# Altium schematic sheet RGB_sensor_.SchDoc
size Letter; SheetNumber: 1; SheetTotal: 1
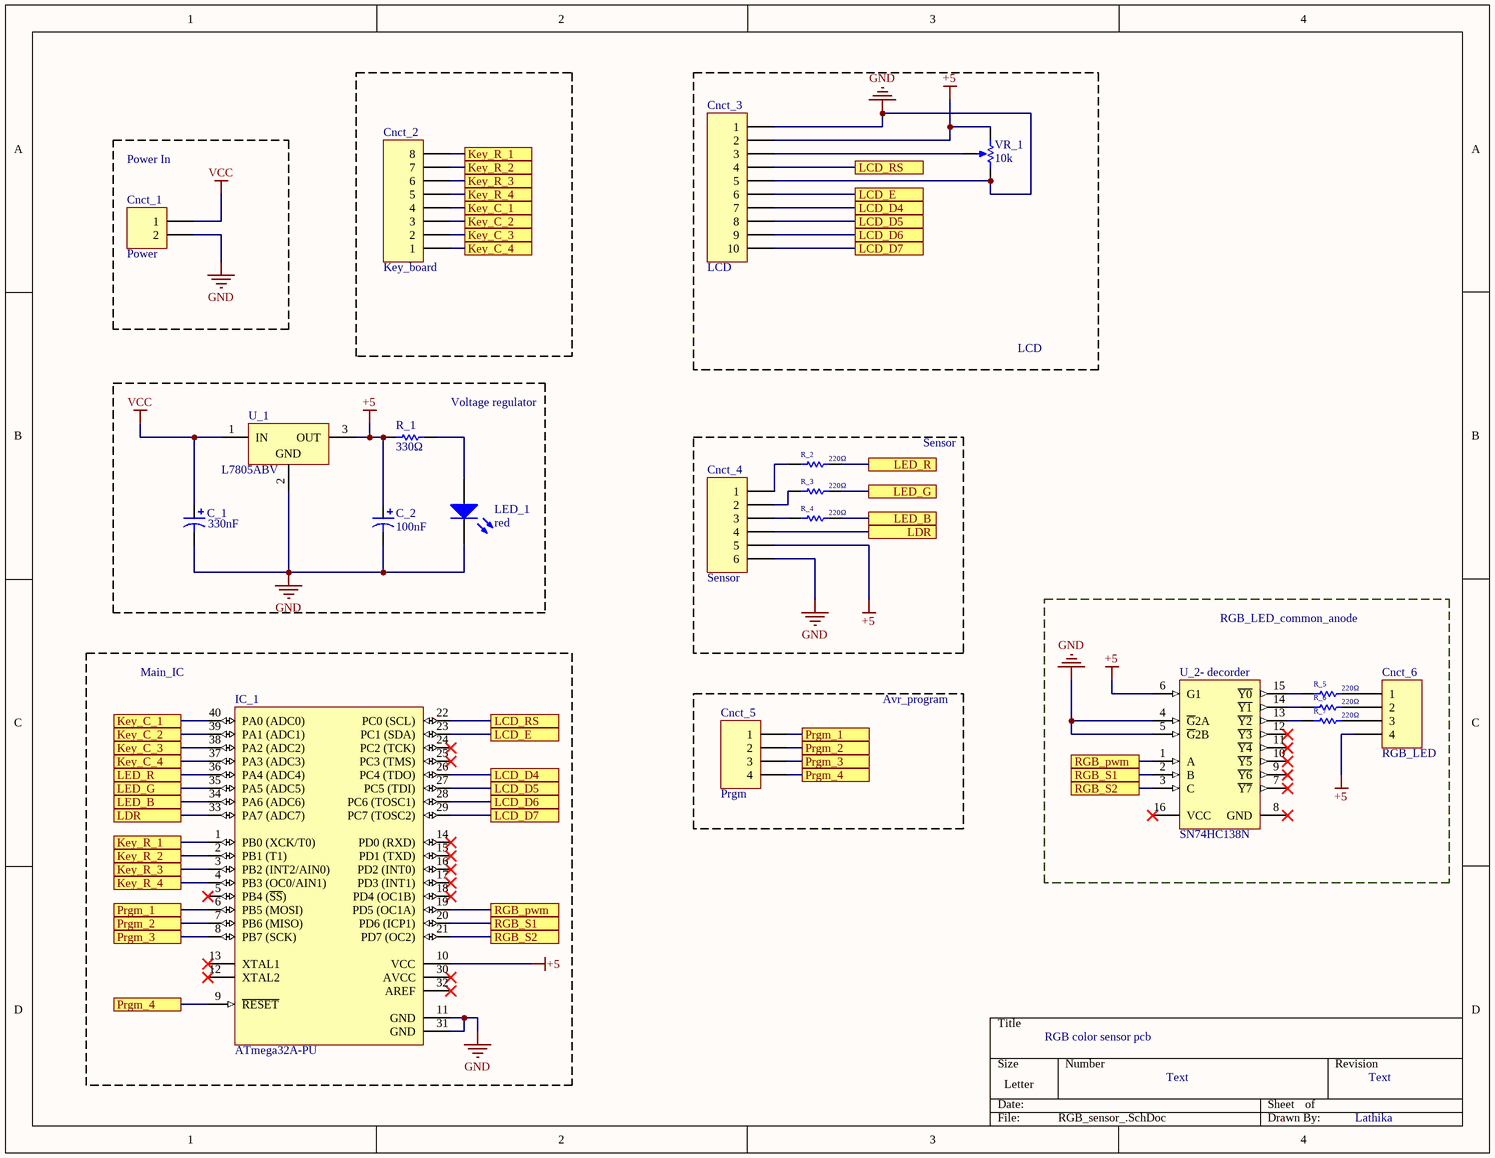
[diagram p0: RGB_sensor_.SchDoc]

## Parts
C_1  330nF  [RB7.6-15]
C_2  100nF  [RB7.6-15]
Cnct_1  Power  [HDR1X2]
Cnct_2  Key_board  [HDR1X8]
Cnct_3  LCD  [HDR1X10]
Cnct_4  Sensor  [HDR1X6]
Cnct_5  Prgm  [HDR1X4]
Cnct_6  RGB_LED  [HDR1X4]
IC_1  ATmega32A-PU  [40P6]
LED_1  red  [Type 5mm]
R_1  330Ω  [AXIAL-0.3]
R_2  220Ω  [AXIAL-0.3]
R_3  220Ω  [AXIAL-0.3]
R_4  220Ω  [AXIAL-0.3]
R_5  220Ω  [AXIAL-0.3]
R_6  220Ω  [AXIAL-0.3]
R_7  220Ω  [AXIAL-0.3]
U_1  L7805ABV  [TO220]
U_2-_decorder  SN74HC138N  [N0016A]
VR_1  10k  [BOUR-3362P]

## Blocks framed on the sheet
LCD: Cnct_3 VR_1
Power In: Cnct_1
Voltage regulator: C_1 C_2 LED_1 R_1 U_1
Sensor: Cnct_4 R_2-R_4
RGB_LED_common_anode: Cnct_6 R_5-R_7 U_2-_decorder
Main_IC: IC_1
Avr_program: Cnct_5

## Ports
Key_C_1, Key_C_2, Key_C_3, Key_C_4, Key_R_1, Key_R_2, Key_R_3, Key_R_4, LCD_D4, LCD_D5, LCD_D6, LCD_D7, LCD_E, LCD_RS, LDR, LED_B, LED_G, LED_R, Prgm_1, Prgm_2, Prgm_3, Prgm_4, RGB_pwm, RGB_S1, RGB_S2

## Nets
+5: C_2.1 Cnct_3.2 Cnct_4.5 Cnct_6.4 IC_1.10(VCC) R_1.1 U_1.3(OUT) U_2-_decorder.6(G1) VR_1.1(CCW)
GND: C_1.2 C_2.2 Cnct_1.2 Cnct_3.1 Cnct_3.5 Cnct_4.6 IC_1.11(GND) IC_1.31(GND) LED_1.1(K) U_1.2(GND) U_2-_decorder.4(~{G}2A) U_2-_decorder.5(~{G}2B) VR_1.3(CW)
VCC: C_1.1 Cnct_1.1 U_1.1(IN)
Key_C_1: Cnct_2.4 IC_1.40(PA0_(ADC0)) ; port Key_C_1
Key_C_2: Cnct_2.3 IC_1.39(PA1_(ADC1)) ; port Key_C_2
Key_C_3: Cnct_2.2 IC_1.38(PA2_(ADC2)) ; port Key_C_3
Key_C_4: Cnct_2.1 IC_1.37(PA3_(ADC3)) ; port Key_C_4
Key_R_1: Cnct_2.8 IC_1.1(PB0_(XCK/T0)) ; port Key_R_1
Key_R_2: Cnct_2.7 IC_1.2(PB1_(T1)) ; port Key_R_2
Key_R_3: Cnct_2.6 IC_1.3(PB2_(INT2/AIN0)) ; port Key_R_3
Key_R_4: Cnct_2.5 IC_1.4(PB3_(OC0/AIN1)) ; port Key_R_4
LCD_D4: Cnct_3.7 IC_1.26(PC4_(TDO)) ; port LCD_D4
LCD_D5: Cnct_3.8 IC_1.27(PC5_(TDI)) ; port LCD_D5
LCD_D6: Cnct_3.9 IC_1.28(PC6_(TOSC1)) ; port LCD_D6
LCD_D7: Cnct_3.10 IC_1.29(PC7_(TOSC2)) ; port LCD_D7
LCD_E: Cnct_3.6 IC_1.23(PC1_(SDA)) ; port LCD_E
LCD_RS: Cnct_3.4 IC_1.22(PC0_(SCL)) ; port LCD_RS
LDR: Cnct_4.4 IC_1.33(PA7_(ADC7)) ; port LDR
LED_B: IC_1.34(PA6_(ADC6)) R_4.2 ; port LED_B
LED_G: IC_1.35(PA5_(ADC5)) R_3.2 ; port LED_G
LED_R: IC_1.36(PA4_(ADC4)) R_2.2 ; port LED_R
Prgm_1: Cnct_5.1 IC_1.6(PB5_(MOSI)) ; port Prgm_1
Prgm_2: Cnct_5.2 IC_1.7(PB6_(MISO)) ; port Prgm_2
Prgm_3: Cnct_5.3 IC_1.8(PB7_(SCK)) ; port Prgm_3
Prgm_4: Cnct_5.4 IC_1.9(~{RESET}) ; port Prgm_4
RGB_pwm: IC_1.19(PD5_(OC1A)) U_2-_decorder.1(A) ; port RGB_pwm
RGB_S1: IC_1.20(PD6_(ICP1)) U_2-_decorder.2(B) ; port RGB_S1
RGB_S2: IC_1.21(PD7_(OC2)) U_2-_decorder.3(C) ; port RGB_S2
NetCnct_3_3: Cnct_3.3 VR_1.2(S)
NetCnct_4_1: Cnct_4.1 R_2.1
NetCnct_4_2: Cnct_4.2 R_3.1
NetCnct_4_3: Cnct_4.3 R_4.1
NetCnct_6_1: Cnct_6.1 R_5.2
NetCnct_6_2: Cnct_6.2 R_6.2
NetCnct_6_3: Cnct_6.3 R_7.2
NetLED_1_2: LED_1.2(A) R_1.2
NetR_5_1: R_5.1 U_2-_decorder.15(~{Y0})
NetR_6_1: R_6.1 U_2-_decorder.14(~{Y1})
NetR_7_1: R_7.1 U_2-_decorder.13(~{Y2})

Not connected (* = marked no-connect by the designer): IC_1 5(PB4_(~{SS}))* 12(XTAL2)* 13(XTAL1)* 14(PD0_(RXD))* 15(PD1_(TXD))* 16(PD2_(INT0))* 17(PD3_(INT1))* 18(PD4_(OC1B))* 24(PC2_(TCK))* 25(PC3_(TMS))* 30(AVCC)* 32(AREF)*; U_2-_decorder 7(~{Y7})* 8(GND)* 9(~{Y6})* 10(~{Y5})* 11(~{Y4})* 12(~{Y3})* 16(VCC)*

## Notes on the sheet
- RGB color sensor pcb
- Text
- Lathika

## Library data of the parts
C_1 C_2 = Cap Pol1: Polarized Capacitor (Radial); Published: 8-Jun-2000; LatestRevisionDate: 17-Jul-2002; LatestRevisionNote: Re-released for DXP Platform.; PackageReference: RB7.6-15; Publisher: Altium Limited; PackageDescription: Polarized Capacitor (Radial); 2 Leads
  C_1: Value: 330nF
  C_2: Value: 100nF
Cnct_1 = Header 2: Header, 2-Pin; LatestRevisionDate: 17-Jul-2002; LatestRevisionNote: Re-released for DXP Platform.; Publisher: Altium Limited
Cnct_2 = Header 8: Header, 8-Pin; LatestRevisionDate: 17-Jul-2002; LatestRevisionNote: Re-released for DXP Platform.; Publisher: Altium Limited
Cnct_3 = Header 10: Header, 10-Pin; LatestRevisionDate: 17-Jul-2002; LatestRevisionNote: Re-released for DXP Platform.; Publisher: Altium Limited
Cnct_4 = Header 6: Header, 6-Pin; LatestRevisionDate: 17-Jul-2002; LatestRevisionNote: Re-released for DXP Platform.; Publisher: Altium Limited
Cnct_5 Cnct_6 = Header 4: Header, 4-Pin; LatestRevisionDate: 17-Jul-2002; LatestRevisionNote: Re-released for DXP Platform.; Publisher: Altium Limited
IC_1 = CMP-0095-00028-2: 8-bit AVR Microcontroller, 2.7-5.5V, 16MHz, 32KB Flash, 1KB EEPROM, 2KB SRAM, 40-pin PDIP, Industrial Grade (-40°C to 85°C); Code_JEDEC: MS-011-AC; ComponentLink3Description: ATmega32A Summary; PackageVersion: revB, Sep-2001; ComponentLink2Description: ATmega32A Datasheet; ComponentLink3URL: http://www.atmel.com/dyn/resources/prod_documents/8155S.pdf; PackageDescription: 40-lead (0.600"/15.24mm Wide) Plastic Dual Inline Package (PDIP); ComponentLink1Description: Manufacturer URL; PackageReference: 40P6; DatasheetVersion: revC, Feb-2011; ComponentLink2URL: http://www.atmel.com/dyn/resources/prod_documents/doc8155.pdf; RevisionNote: DatasheetVersion updated. URLs added.; ComponentLink1URL: http://www.atmel.com/
LED_1 = CMP-1488-00008-1: THT LED round mono-color color lens, WL-TMRW, Red; PartNumber: 151051RS11000; Manufacturer: Wuerth Elektronik; PackageReference: Type 5mm; ComponentLink2URL: http://katalog.we-online.de/pbs/datasheet/7448042001.pdfhttp://katalog.we-online.de/pbs/datasheet/7448042001.pdfhttp://katalog.we-online.de/pbs/datasheet/7448042001.pdfhttp://katalog.we-online.de/pbs/datasheet/151051RS11000.pdf; ComponentLink1URL: http://www.we-online.com; ComponentLink1Description: Manufacturer URL; ComponentLink2Description: Datasheet; Emitting color: Red
R_1-R_7 = Res1: Resistor; Published: 8-Jun-2000; LatestRevisionDate: 17-Jul-2002; LatestRevisionNote: Re-released for DXP Platform.; PackageReference: AXIAL-0.3; Publisher: Altium Limited; PackageDescription: Axial Device, Thru-Hole; 2 Leads; 0.3 in Pin Spacing
  R_1: Value: 330Ω
  R_2-R_7: Value: 220Ω
U_1 = CMP-0244-00485-1: Positive Voltage Regulator, 5V, 3-Pin TO-220; ComponentLink1URL: http://www.st.com; PackageDescription: TO, Thru-Hole, Vertical, Heatsink Mounted; 3 In-Line Leads; Pitch 2.54 mm; DatasheetVersion: 16/11/2011; ComponentLink2Description: Datasheet; ComponentLink1Description: Manufacturer URL; PackageReference: TO220; ComponentLink3Description: Package Specification; ComponentLink2URL: http://www.st.com/internet/com/TECHNICAL_RESOURCES/TECHNICAL_LITERATURE/DATASHEET/CD00000444.pdf; ComponentLink3URL: http://www.st.com/internet/com/TECHNICAL_RESOURCES/TECHNICAL_LITERATURE/PACKAGE_INFORMATION/CD00004649.pdf; PackageVersion: ver3.0
U_2-_decorder = CMP-1633-00627-2: 3-Line To 8-Line Decoders/Demultiplexers, N0016A, TUBE; Manufacturer: Texas Instruments; Bits(#): 8; Function: Decoder/Demultiplexer; F @ Nom Voltage(Max)(Mhz): 28; Input Type: LVTTL/CMOS; VCC(Min)(V): 2; VCC(Max)(V): 6; Technology Family: HC; Rating: Catalog; Schmitt Trigger: No; Voltage(Nom)(V): 3.3,5; Output Type: CMOS; Channels(#): 1; Output Drive (IOL/IOH)(Max)(mA): 5.2/-5.2; ICC @ Nom Voltage(Max)(mA): 0.08; tpd @ Nom Voltage(Max)(ns): 45; Configuration: 3：8; DatasheetVersion: SCLS107E; Type: Standard; PackageReference: N0016A; Generic Part Number: SN74HC138; Code_JEDEC: MS-001; Operating Temperature Range(C): -40 to 85
VR_1 = CMP-1747-00003-1: Square Trimpot(R) Trimming Potentiometer, 100 KOhm, 300 V, -55 to 125 degC, 3-Pin THD, RoHS, Tube; Voltage Rating: 250 V; Case\Package: Axial; Tolerance: 1%; Power Rating: 250 mW; RoHSCompliant: true; ComponentLink2URL: http://www.bourns.com/docs/Product-Datasheets/3362.pdf; ComponentLink1Description: Manufacturer URL; DatasheetVersion: May-16; Package Quantity: 200; ComponentLink2Description: Datasheet; Min Operating Temperature: -55 degC; Resistance: 10k; Mount: Through Hole; PackageDescription: 3-Pin Through Hole Device, Body 6.6 x 6.99 mm, Pitch 2.54 mm; Length: 0.248 inch; ComponentLink1URL: http://www.bourns.com/; PackageReference: 3326P; Max Operating Temperature: 155 degC; Packaging: Bulk